# EAGLE design IMU Layer final (EAGLE 6.1)
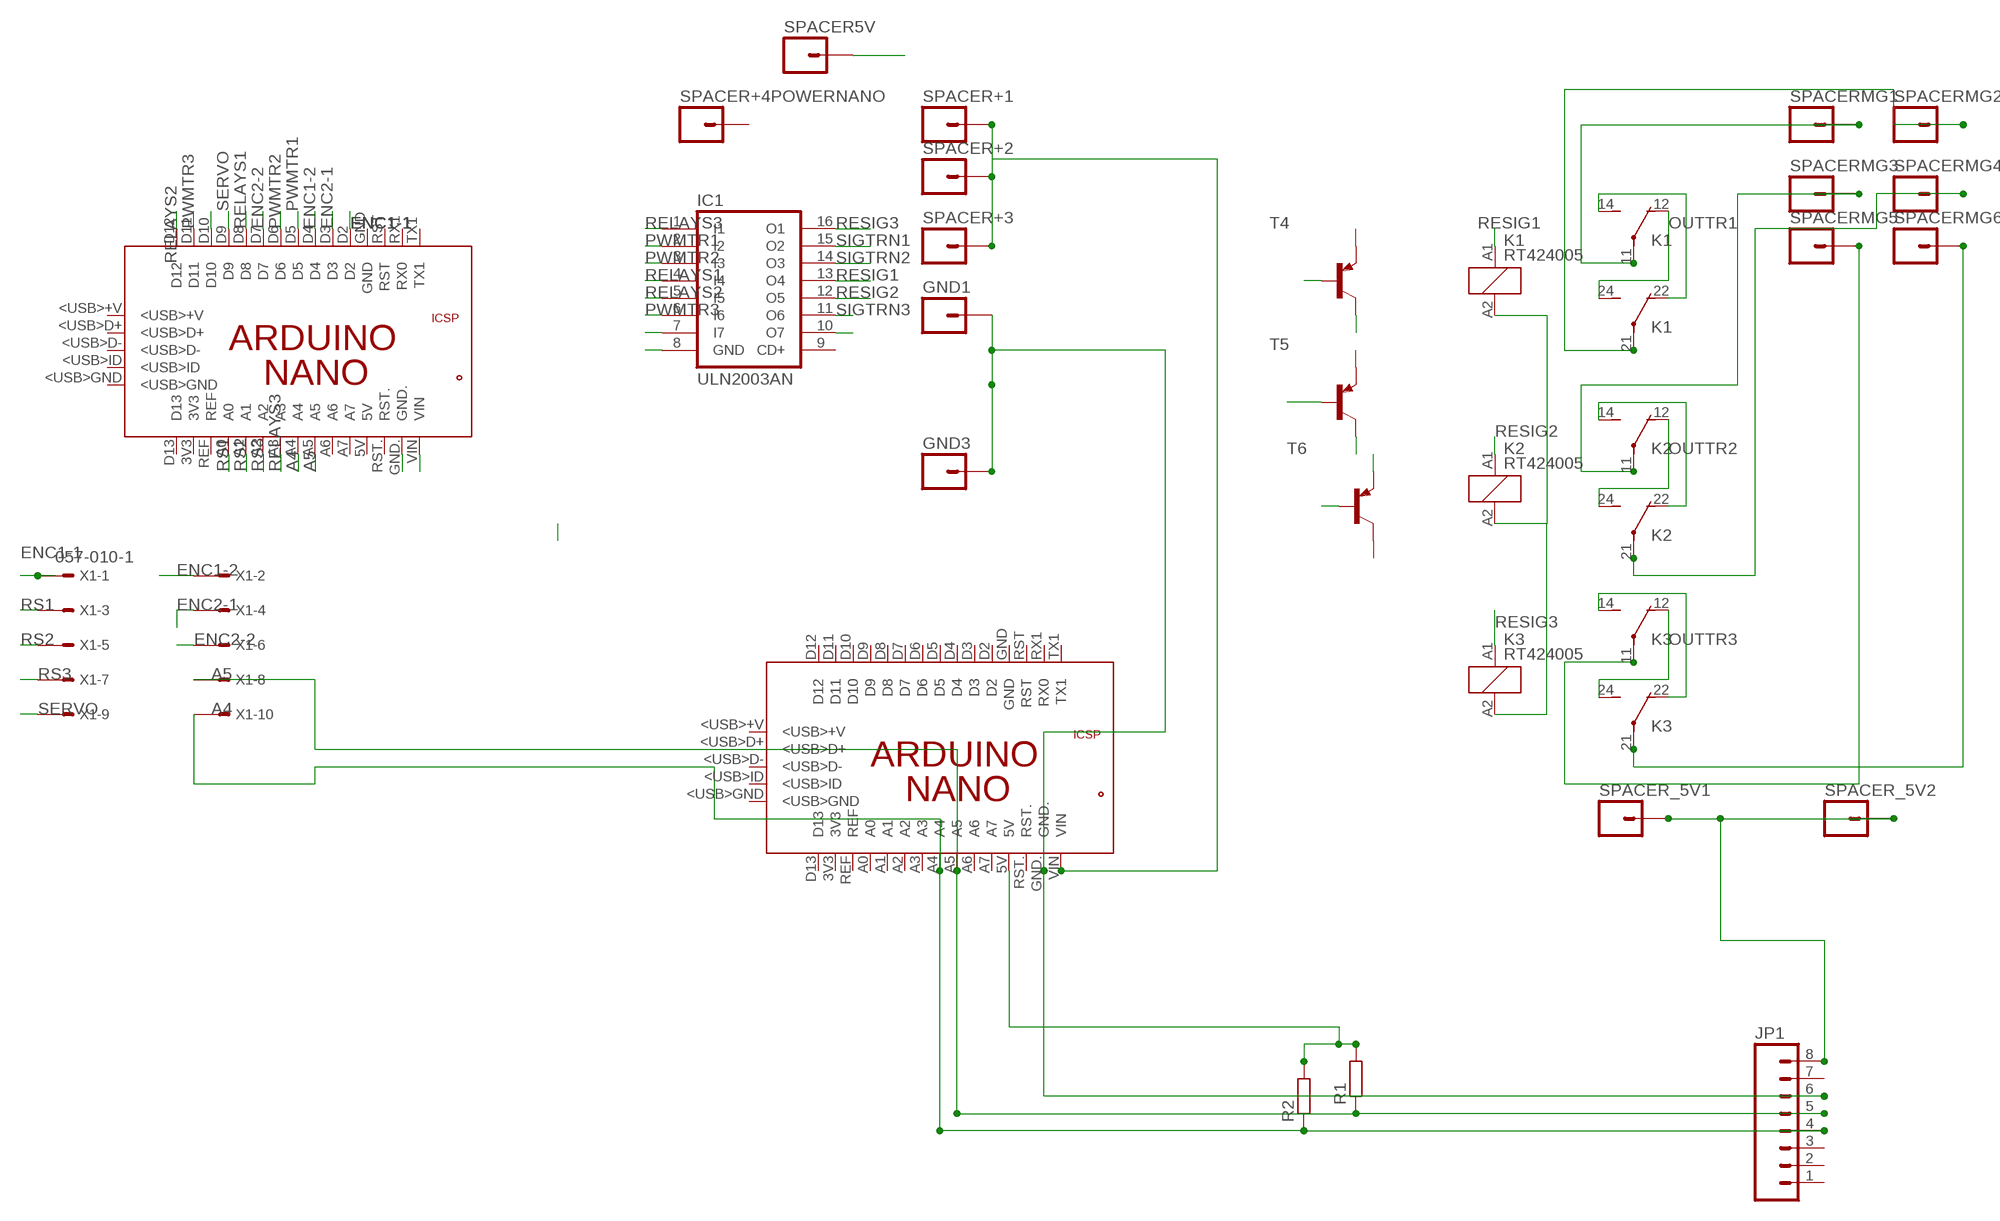
[diagram p0: schematic, sheet 1]

## Parts
GND1  M01PTH_2MM  [1X01_2MM]
GND3  M01PTH_2MM  [1X01_2MM]
IC1  ULN2003AN  [DIL16]
JP1  M08LONGPADS  [1X08_LONGPADS]
K1  RT424005  [RT2C/O]
K2  RT424005  [RT2C/O]
K3  RT424005  [RT2C/O]
PCB1  ARDUINO_NANO  [ARDUINO_NANO]
PCB3  ARDUINO_NANO  [ARDUINO_NANO]
R1  R-EU_0207/12  [0207/12]
R2  R-EU_0207/12  [0207/12]
SPACER5V  M01PTH_2MM  [1X01_2MM]
SPACER+1  M01PTH_2MM  [1X01_2MM]
SPACER+2  M01PTH_2MM  [1X01_2MM]
SPACER+3  M01PTH_2MM  [1X01_2MM]
SPACER+4POWERNANO  M01PTH_2MM  [1X01_2MM]
SPACER_5V1  M01PTH_2MM  [1X01_2MM]
SPACER_5V2  M01PTH_2MM  [1X01_2MM]
SPACERMG1  M01PTH_2MM  [1X01_2MM]
SPACERMG2  M01PTH_2MM  [1X01_2MM]
SPACERMG3  M01PTH_2MM  [1X01_2MM]
SPACERMG4  M01PTH_2MM  [1X01_2MM]
SPACERMG5  M01PTH_2MM  [1X01_2MM]
SPACERMG6  M01PTH_2MM  [1X01_2MM]
T4  -PNP-TO218  [TO218]
T5  -PNP-TO218  [TO218]
T6  -PNP-TO218  [TO218]
X1  057-010-1  [057-010-1]

## Nets
5V: JP1.8 SPACER5V.1 SPACER_5V1.1 SPACER_5V2.1
A4: JP1.4 PCB1.A4 PCB3.A4 R2.1 X1.10
A5: JP1.5 PCB1.A5 PCB3.A5 R1.1 X1.8
ENC1-1: PCB1.D2 X1.1
ENC1-2: PCB1.D4 X1.2
ENC2-1: PCB1.D3 X1.4
ENC2-2: PCB1.D7 X1.6
GND: GND1.1 GND3.1 IC1.8(GND) JP1.6 PCB1.GND. PCB3.GND. T4.3(E) T5.3(E) T6.3(E)
N$1: K1.11(2:P) SPACERMG1.1
N$2: K1.21(3:P) SPACERMG2.1
N$3: PCB3.5V R1.2 R2.2
N$5: K2.11(2:P) SPACERMG3.1
N$6: K2.21(3:P) SPACERMG4.1
N$7: K3.11(2:P) SPACERMG5.1
N$8: K3.21(3:P) SPACERMG6.1
N$12: PCB1.D10
N$18: IC1.7(I7)
N$26: IC1.10(O7)
OUTTR1: K1.12(2:O) K1.24(3:S) T4.2(C)
OUTTR2: K2.12(2:O) K2.24(3:S) T5.2(C)
OUTTR3: K3.12(2:O) K3.24(3:S) T6.2(C)
POWER: K1.14(2:S) K1.22(3:O) K1.A2 K2.14(2:S) K2.22(3:O) K2.A2 K3.14(2:S) K3.22(3:O) K3.A2 PCB1.VIN PCB3.VIN SPACER+1.1 SPACER+2.1 SPACER+3.1
PWMTR1: IC1.2(I2) PCB1.D5
PWMTR2: IC1.3(I3) PCB1.D6
PWMTR3: IC1.6(I6) PCB1.D11
RELAYS1: IC1.4(I4) PCB1.D8
RELAYS2: IC1.5(I5) PCB1.D12
RELAYS3: IC1.1(I1) PCB1.A3
RESIG1: IC1.13(O4) K1.A1
RESIG2: IC1.12(O5) K2.A1
RESIG3: IC1.16(O1) K3.A1
RS1: PCB1.A0 X1.3
RS2: PCB1.A1 X1.5
RS3: PCB1.A2 X1.7
SERVO: PCB1.D9 X1.9
SIGTRN1: IC1.15(O2) T4.1(B)
SIGTRN2: IC1.14(O3) T5.1(B)
SIGTRN3: IC1.11(O6) T6.1(B)
Unconnected: IC1.9(CD+) JP1.1 JP1.2 JP1.3 JP1.7 PCB1.3V3 PCB1.5V PCB1.5V. PCB1.<USB>+V PCB1.<USB>D+ PCB1.<USB>D- PCB1.<USB>GND PCB1.<USB>ID PCB1.A6 PCB1.A7 PCB1.D13 PCB1.GND PCB1.GND_ PCB1.MISO PCB1.MOSI PCB1.REF PCB1.RESET.. PCB1.RST PCB1.RST. PCB1.RX1(RX0) PCB1.SCK PCB1.TX1 PCB3.3V3 PCB3.5V. PCB3.<USB>+V PCB3.<USB>D+ PCB3.<USB>D- PCB3.<USB>GND PCB3.<USB>ID PCB3.A0 PCB3.A1 PCB3.A2 PCB3.A3 PCB3.A6 PCB3.A7 PCB3.D2 PCB3.D3 PCB3.D4 PCB3.D5 PCB3.D6 PCB3.D7 PCB3.D8 PCB3.D9 PCB3.D10 PCB3.D11 PCB3.D12 PCB3.D13 PCB3.GND PCB3.GND_ PCB3.MISO PCB3.MOSI PCB3.REF PCB3.RESET.. PCB3.RST PCB3.RST. PCB3.RX1(RX0) PCB3.SCK PCB3.TX1 SPACER+4POWERNANO.1

## Library data of the parts
GND1 GND3 SPACER5V SPACER+1-SPACER+3 SPACER+4POWERNANO SPACER_5V1 SPACER_5V2 SPACERMG1-SPACERMG6 = SparkFun-Connectors:M01: Header 1 Standard 1-pin 0.1" header. Use with straight break away headers (SKU : PRT-00116), right angle break away headers (PRT-00553), swiss pins (PRT-00743), machine pins (PRT-00117), and female headers (PRT-00115).
IC1 = uln-udn:ULN2003A: DRIVER ARRAY
JP1 = SparkFun-Connectors:M08: Header 8 Standard 8-pin 0.1" header. Use with straight break away headers (SKU : PRT-00116), right angle break away headers (PRT-00553), swiss pins (PRT-00743), machine pins (PRT-00117), and female headers (PRT-00115).
K1-K3 = relay:RT42?*: Power PCB Relay SCHRACK 2 pole 8 A, DC and AC-coil Source: http://www.schrack.com/.. 5842.pdf; MPN: RT424005; OC_FARNELL: 1629052; OC_NEWARK: 03P2425
PCB1 PCB3 = E14_Arduino_revB:ARDUINO_NANO: Device for representing an Arduino Nano board with a footprint in an EAGLE design. Created by Dave Young for Element14. More EAGLE documentation at: http://www.element14.com/community/community/knode/cadsoft_eagle
R1 R2 = resistor:R-EU_: RESISTOR, European symbol
T4-T6 = transistor:*-PNP-: PNP Transistror
X1 = con-panduit:057-010-: CONNECTOR 10-pin series 057 contact pc board low profile headers; OC_FARNELL: unknown; OC_NEWARK: unknown

## Board
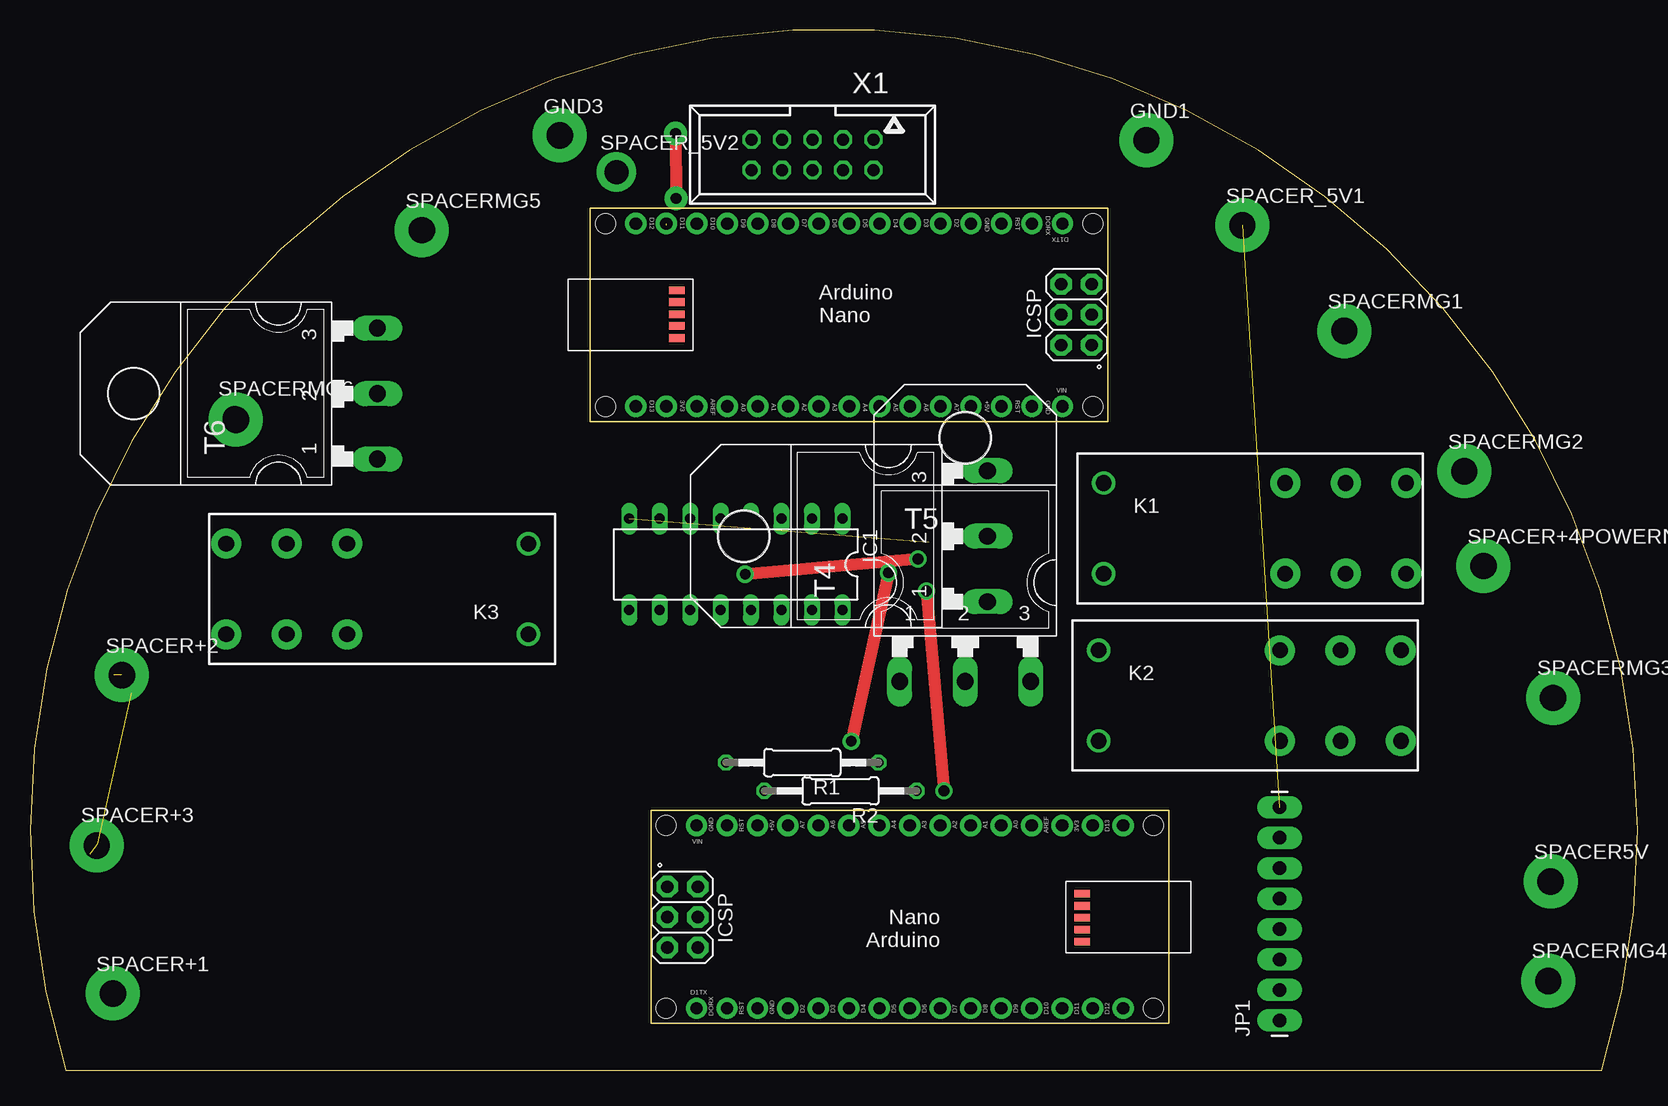
[diagram p1: board, top side]
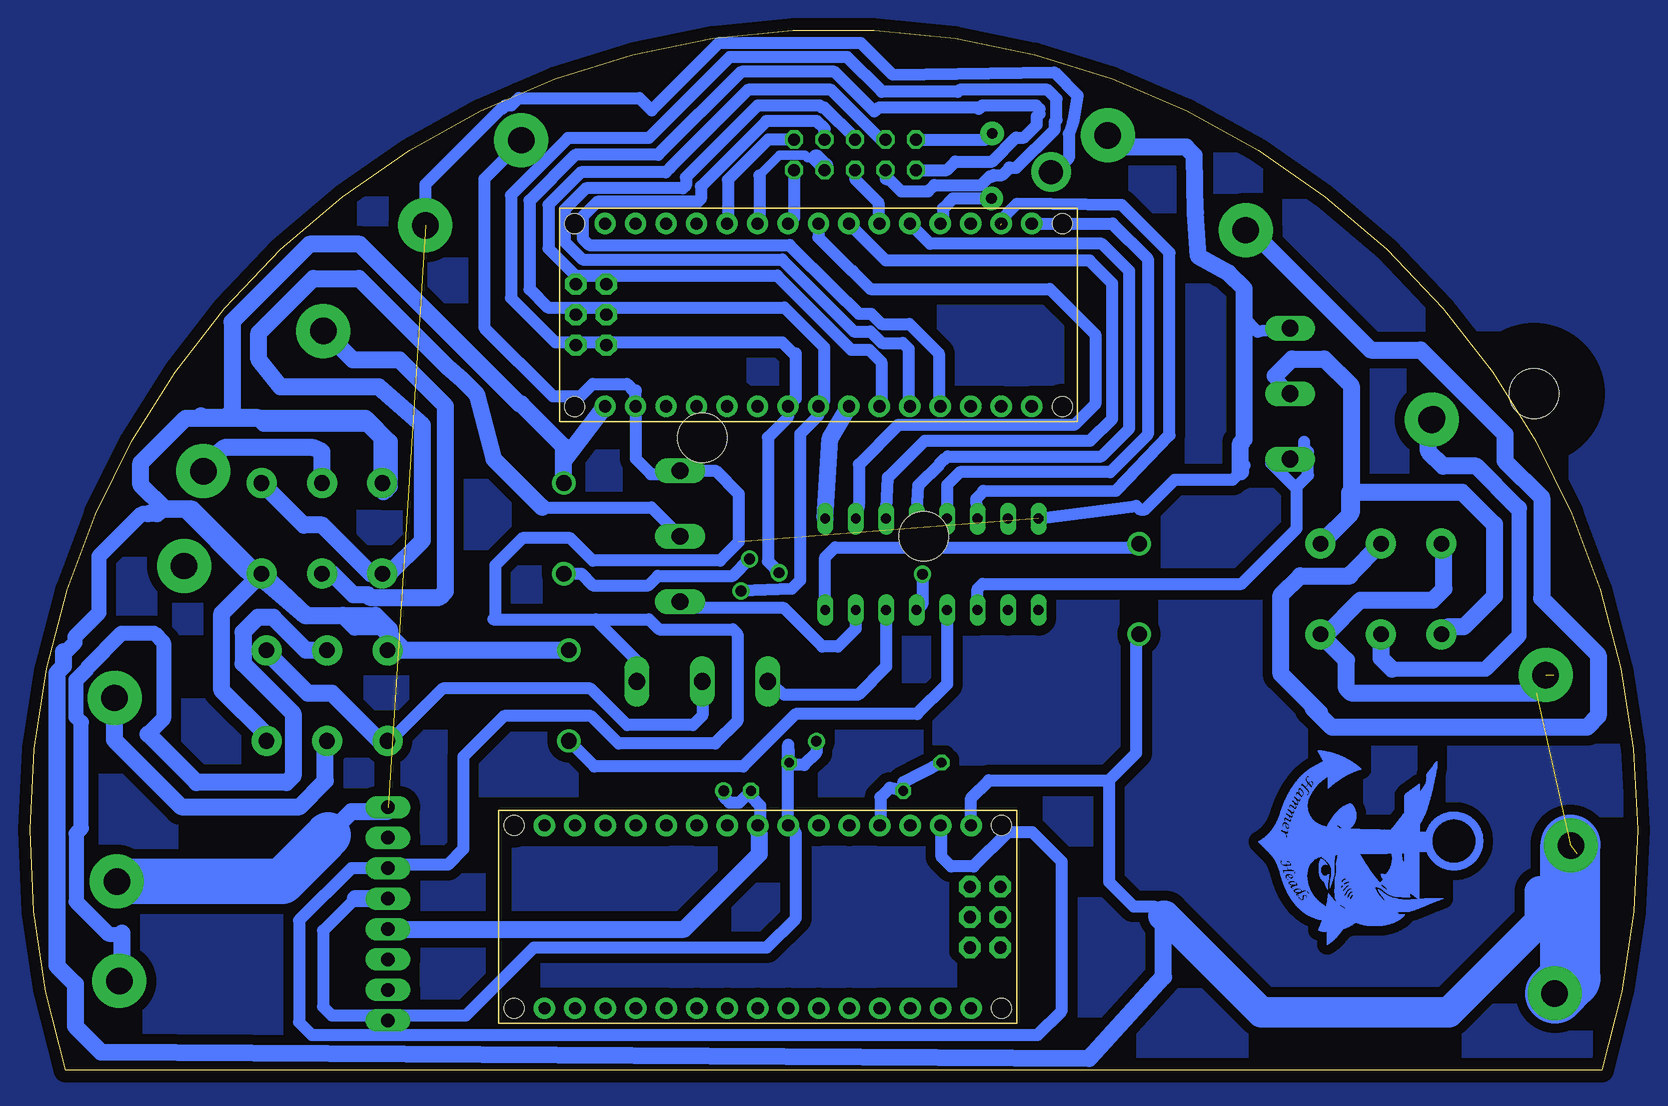
[diagram p2: board, bottom side, seen from below]

Size 134.01 x 86.73 mm. Coordinates in mm from the lower left corner, seen from the top.
Outline: 131.01,0 arc214 3,0 131.01,0
Copper layers (1*16): Top 0.035mm / dielectric 1.5mm / Bottom 0.035mm
Design rules: minimum track width 10mil, minimum drill 24mil, track to track 8mil, track to pad 8mil, pad to pad 8mil, via to via 8mil, smd to smd 8mil, copper to edge 40mil, drill to drill 8mil, minimum pad ring 10mil, minimum via ring 8mil, stop-mask expansion 4mil, vias tented up to drill 0mil, thermal gap 10mil

### Footprints (pad centres in the part's own frame; a part is rotated, then mirrored left to right if it is on the bottom)
1X01_2MM = drill 2 pad 3.302: 1 0,0
DIL16 = drill 0.813 long: 1 -8.89,-3.81; 2 -6.35,-3.81; 3 -3.81,-3.81; 4 -1.27,-3.81; 5 1.27,-3.81; 6 3.81,-3.81; 7 6.35,-3.81; 8 8.89,-3.81; 9 8.89,3.81; 10 6.35,3.81; 11 3.81,3.81; 12 1.27,3.81; 13 -1.27,3.81; 14 -3.81,3.81; 15 -6.35,3.81; 16 -8.89,3.81
1X08_LONGPADS = drill 1.118 pad 1.88 long: 1 0,0; 2 2.54,0; 3 5.08,0; 4 7.62,0; 5 10.16,0; 6 12.7,0; 7 15.24,0; 8 17.78,0
RT2C/O = drill 1.3 pad 2.5: 11 7.56,-3.68; 12 2.52,-3.68; 14 12.6,-3.68; 21 7.56,3.88; 22 2.52,3.88; 24 12.6,3.88 | drill 1.3: A1 -12.6,-3.68; A2 -12.6,3.88
ARDUINO_NANO = drill 1.016 pad 1.778: 3V3 6.35,1.27; 5V 31.75,1.27; A0 11.43,1.27; A1 13.97,1.27; A2 16.51,1.27; A3 19.05,1.27; A4 21.59,1.27; A5 24.13,1.27; A6 26.67,1.27; A7 29.21,1.27; D2 29.21,16.51; D3 26.67,16.51; D4 24.13,16.51; D5 21.59,16.51; D6 19.05,16.51; D7 16.51,16.51; D8 13.97,16.51; D9 11.43,16.51; D10 8.89,16.51; D11 6.35,16.51; D12 3.81,16.51; D13 3.81,1.27; GND 31.75,16.51; GND. 36.83,1.27; REF 8.89,1.27; RST 34.29,16.51; RST. 34.29,1.27; RX1 36.83,16.51; TX1 39.37,16.51; VIN 39.37,1.27 | drill 1.016 pad 1.778 octagon: 5V. 39.268,6.375; GND_ 39.268,11.455; MISO 41.808,6.375; MOSI 39.268,8.915; RESET.. 41.808,11.455; SCK 41.808,8.915 | smd 1.27 x 0.635: <USB>+V 7.214,10.947; <USB>D+ 7.214,9.957; <USB>D- 7.214,8.941; <USB>GND 7.214,6.96; <USB>ID 7.214,7.976 | hole 1.651: 1.27,1.27; 1.27,16.51; 41.91,16.51; 41.91,1.27
0207/12 = drill 0.813 octagon: 1 -6.35,0; 2 6.35,0
TO218 = drill 1.397 long: 1 -5.461,-10.16; 2 0,-10.16; 3 5.461,-10.16 | hole 4.115: 0,10.16
057-010-1 = drill 1 octagon: 1 -5.08,-1.27; 2 -5.08,1.27; 3 -2.54,-1.27; 4 -2.54,1.27; 5 0,-1.27; 6 0,1.27; 7 2.54,-1.27; 8 2.54,1.27; 9 5.08,-1.27; 10 5.08,1.27

### Placement (x,y rotation side)
GND1  93.03,77.54 0 top
GND3  44.15,77.92 0 top
IC1  58.83,42.18 180 top
JP1  104.16,4.15 90 top
K1  102.11,45.08 0 top
K2  101.68,31.14 0 top
K3  28.95,40.23 180 top
PCB1  46.69,54.08 0 top
PCB3  94.93,21.68 180 top
R1  64.37,25.65 180 top
R2  67.56,23.3 180 top
SPACER5V  126.71,15.77 0 top
SPACER+1  6.87,6.41 0 top
SPACER+2  7.66,32.95 0 top
SPACER+3  5.59,18.83 0 top
SPACER+4POWERNANO  121.17,42.06 0 top
SPACER_5V1  101.04,70.46 0 top
SPACER_5V2  48.88,74.89 0 top
SPACERMG1  109.52,61.66 0 top
SPACERMG2  119.55,49.96 0 top
SPACERMG3  126.98,31.11 0 top
SPACERMG4  126.52,7.52 0 top
SPACERMG5  32.65,70.04 0 top
SPACERMG6  17.04,54.39 0 top
T4  69.65,44.53 90 top
T5  77.96,42.57 0 top
T6  18.8,56.41 90 top
X1  65.23,76.33 180 top

### Tracks (layer width: path | path; a pad name or v marks a point on that pad's centre or on a via)
5V  (1 unrouted)
  Bottom 1: SPACER_5V1.1 101.04,73.86 94.76,80.14 94.66,80.14 94.36,80.44 93.86,80.44 93.26,81.04 83.2,81.04 82.18,80.03 76.55,85.66 64.76,85.66 62.1,83 48.62,83.2 46.68,81.26 47.08,79.01 47.41,78.08 47.41,76.06 48.79,74.68 48.79,74.8 SPACER_5V2.1 | 48.8,75.71 49.29,75.22 49.21,75.22 SPACER_5V2.1 | SPACER_5V2.1 48.88,74.84 48.99,74.73
  Bottom 1.422: JP1.8 104.16,21.65 104.26,21.55 107.22,21.55 109.55,19.23
  Bottom 3.81: SPACER5V.1 113,15.77 109.55,19.23 109.16,19.61
A4  (via drill 0.9 pad 1.42)
  Top 1.016: v74.73,39.96 v76.18,23.29
  Bottom 1: PCB1.A4 67.81,55.82 67.81,60.29 71.11,63.59 90.85,63.59 92.37,65.11 92.37,72.5 88.55,76.32 81.63,76.32 74.71,83.24 66.93,83.24 63.62,79.93 63.31,80.24 54.92,80.24 54.92,80.14 54.64,80.42 50.13,80.42 49.85,80.14 49.85,79.71 49.9,79.71 50.07,79.54 50.07,78.82 51.13,77.76 51.8,77.76 53.79,75.77 56.86,75.77 57.57,75.06 X1.10
  Bottom 1.016: PCB3.A4 73.13,20.62 73.13,22.05 73.91,22.82 R2.1 74.88,22.33 75.7,22.33 76.18,22.81 v76.18,23.29 | PCB1.A4 68.28,54.58 69.81,53.06 69.81,40.84 70.52,40.13 v74.73,39.96
  Bottom 1.422: JP1.4 79.47,11.77 73.2,18.04 73.2,19.59 PCB3.A4
A5  (via drill 0.9 pad 1.42)
  Top 1.016: v71.56,41.48 v68.46,27.43
  Bottom 1: X1.8 62.69,74.3 62.4,74.3 61.39,73.29 59.14,73.29 58.62,73.81 54.72,73.81 54.01,74.52 53.76,74.52 53.65,74.63 52.95,74.63 52.37,75.21 | 70.19,59.79 70.19,59.57 | 70.19,59.57 70.19,55.98 PCB1.A5 | JP1.5 106.91,14.31 109.58,11.64 109.58,5.31 108.84,4.57 97.67,4.57 92,10.24 72.59,10.24 70.16,12.67 | 56.58,81.66 56.65,81.59 56.66,81.59 | 56.66,81.59 56.67,81.58 63,81.58 65.89,84.47 75.68,84.47 82.44,77.71 89.15,77.71 93.92,72.94 93.92,64.39 90.22,60.69 71.31,60.69 70.19,59.57 | 52.37,75.21 52.37,75.28 52.32,75.28 | 56.66,81.59 56.52,81.73 49.18,81.73 48.43,80.98 48.43,79.22 48.6,79.05 48.58,79.03 48.58,78.45 51.8,75.23 52.35,75.23 52.37,75.21
  Bottom 1.016: 70.16,12.67 70.16,19.77 PCB3.A5 70.8,27.14 R1.1 70.52,25.45 69.48,25.45 68.46,26.47 v68.46,27.43 | PCB1.A5 70.82,54.43 72.5,52.76 72.5,42.42 v71.56,41.48
  Bottom 1.422: JP1.5 106.86,14.31
ENC1-1
  Bottom 1: X1.1 72.47,77.6 75.83,74.24 75.83,70.61 75.88,70.56 75.88,70.57 PCB1.D2
ENC1-2
  Bottom 1: X1.2 70.31,71.1 PCB1.D4
ENC2-1
  Bottom 0.8: 68.47,76.08 69.19,76.08 69.42,76.31 71.51,76.31 73.21,74.61
  Bottom 1: 73.21,74.61 73.21,70.57 73.48,70.3 73.48,70.47 PCB1.D3
  Bottom 1.422: X1.4 67.77,75.38 68.47,76.08
ENC2-2
  Bottom 1: X1.6 65.23,74.3 63.28,72.35 63.28,70.67 PCB1.D7 | PCB1.D7 63.16,70.55 63.16,70.63 | 63.16,70.82 63.16,70.63 | 63.16,70.63 PCB1.D7
GND  (1 unrouted)
  Bottom 1: PCB1.GND. 83.52,56.59 | 83.52,56.59 83.52,56.69 | GND1.1 92.97,77.48 92.95,77.48 96.13,74.3 96.13,61.92 90.4,56.19 88.12,56.19 87.1,57.21 84.25,57.21 83.63,56.59 83.52,56.59 | IC1.8 41.79,47.06 41.49,46.76 41.06,46.76 38.58,49.24 33.75,49.24 33.1,49.89 | 32.77,50.45 33.1,50.12 | JP1.6 107.21,16.85 111.58,12.48 111.58,4 110.52,2.94 50.01,2.94 47.99,4.96 47.99,17.38 50.46,19.85
  Bottom 1.016: PCB1.GND. 83.52,50.98 82.25,49.71 79.18,49.71 78.95,49.94 79.76,49.94 T4.3 | 79.86,50.04 T4.3 | T4.3 76.87,49.99 74.94,48.06 74.94,44.04 76.49,42.5 87.1,42.5 88.98,44.38 92.95,44.38 95.23,42.09 95.23,37.75 95.38,37.59 86.85,37.59 | T5.3 83.19,33.94 86.85,37.59 | T6.3 31.68,61.57 32.79,62.69 | 50.46,19.85 52.5,19.85 55.35,16.99 57.23,16.99 58.02,17.78 58.02,20.33 PCB3.GND. | 86.85,37.59 82.4,37.59 81.57,36.76 75.42,36.76 75.04,36.37 75.04,29.08 76.89,27.23 84.94,27.23 87.26,29.54 94.49,29.54 97.9,26.14 97.9,18.44 99.19,17.15 103.87,17.15 JP1.6
  Bottom 1.422: GND1.1 93.24,77.54 93.66,77.96 92.89,77.96 | 33.1,49.89 33.1,50.12 33.1,52.28 32.79,52.59 32.79,62.69 32.79,65.16 34.1,66.47 36.6,67.85 36.85,71.5 36.95,76.27 37.64,76.96 43.19,76.96 GND3.1
N$1
  Bottom 1.422: K1.11 108.8,41.4 107.06,39.66 105.86,39.66 105.84,39.64 105.84,39.59 105.68,39.43 99.87,39.43 99.36,39.94 99.36,55.37 103.21,59.22 107.08,59.22 SPACERMG1.1
N$2
  Bottom 1.422: K1.21 109.67,51.58 110.4,51.9 117.8,51.9 119.54,50.51 119.54,49.43 119.55,49.44 SPACERMG2.1
N$3
  Bottom 1.016: R1.2 61.21,24.03 R2.2 62.34,23.55 63.13,22.76 63.13,20.46 PCB3.5V
N$4
  pour Bottom (isolate 0.813): 1.4,93.04 146.84,93.04 146.84,-7.52 -8.96,-7.52 -8.96,93.96 1.4,93.96
N$5
  Bottom 1.422: SPACERMG3.1 126.98,27.56 121.39,21.97 111.54,21.97 109.38,24.13 109.38,27.32 K2.11
N$6
  Bottom 1.27: 126.34,11.44 126.44,11.34 127.46,11.34 130.16,14.04 130.16,19.74 129.72,20.18 129.72,29.01 130.16,29.44 130.16,32.54 129.16,33.54 129.16,33.64 126.36,36.44 123.66,36.44 122.86,35.64 122.86,29.33 124.16,28.03
  Bottom 1.422: K2.21 110.99,35.02 113.72,37.75 115.02,37.75 116.24,36.53 116.24,33.91 112.07,29.74 112.07,24.54 112.62,23.99 120.12,23.99 124.16,28.03 | 126.34,11.44 126.34,7.83 126.87,7.3 126.74,7.3 SPACERMG4.1
N$7
  Bottom 1.422: 26.95,30.27 29.72,33.04 29.72,39.61 28.12,41.21 23.96,41.21 23.96,41.34 K3.11 | 26.95,30.27 26.49,29.81 | SPACERMG5.1 32.22,70.04 22.24,60.06 18.08,60.06 11.05,53.03 11.05,50.81 8,47.76 8,39.34 3.28,34.62 3.28,29.53 4.21,28.6 25.48,28.6 27.05,30.17 26.95,30.27
N$8
  Bottom 1.27: 20.47,33.45 12.65,33.45 9.86,36.24 9.86,46.77 10.05,46.96
  Bottom 1.422: K3.21 21.39,34.37 20.47,33.45 | 9.93,46.84 10.05,46.96 13.45,50.36 16.21,50.36 17.44,51.59 17.44,54.31 17.12,54.63 17.12,54.47 SPACERMG6.1
N$9  (via drill 2.2 pad 4.5)
  other vias: 6.92,6.4
N$10  (via drill 2.2 pad 4.5)
  other vias: 5.56,18.74
N$11  (via drill 2.2 pad 4.5)
  other vias: 7.66,32.94
N$13  (via drill 2.2 pad 4.5)
  other vias: 17.16,54.24
N$14  (via drill 2.2 pad 4.5)
  other vias: 32.66,70.04
N$15  (via drill 2.2 pad 4.5)
  other vias: 44.16,77.94
N$16  (via drill 2.2 pad 4.5)
  other vias: 93.06,77.54
N$17  (via drill 2.2 pad 4.5)
  other vias: 101.06,70.44
N$19  (via drill 2.2 pad 4.5)
  other vias: 109.56,61.64
N$20  (via drill 2.2 pad 4.5)
  other vias: 119.56,49.94
N$21  (via drill 2.2 pad 4.5)
  other vias: 121.16,42.04
N$22  (via drill 2.2 pad 4.5)
  other vias: 126.76,15.74
N$23  (via drill 2.2 pad 4.5)
  other vias: 126.56,7.44
N$24  (via drill 2.2 pad 4.5)
  other vias: 126.96,31.04
OUTTR1
  Bottom 1.016: 91.3,46.92 82.21,46.92 T4.2
  Bottom 1.422: K1.24 111.19,45.44 109.64,45.44 105.6,41.4 K1.12 104.06,41.4 101.28,44.18 101.28,53.76 104.94,56.96 113.11,56.96 114.94,59.25 114.94,61.47 110.39,66.02 106.58,66.02 99.22,58.66 98,57.59 96.78,56.37 95.34,50.96 91.3,46.92
OUTTR2
  Bottom 1.016: T5.2 77.96,29.57 78.75,28.78 84.23,28.78 87.28,31.83 99.6,31.83 104.1,27.33 104.1,27.35 K2.12
  Bottom 1.422: K2.12 104.87,27.46 108.83,31.42 110.83,31.42 114.16,34.75 114.16,34.9 K2.24
OUTTR3
  Bottom 1.016: T6.2 29.98,57.64 30.23,57.89
  Bottom 1.422: 30.23,57.89 28.81,59.31 26.11,59.31 23.87,57.07 23.87,46.47 K3.12 26.36,43.91 23.99,46.28 23.99,48.14 23.93,48.2 14.63,48.2 11.93,45.5 11.93,39.52 14.49,36.96 15.74,36.96 K3.24
POWER  (3 unrouted)
  Bottom 1.016: PCB3.VIN 55.56,22.71 54.08,24.18 44.05,24.18 | 44.05,24.18 41.79,26.44 41.79,36.12 K3.A2 | 44.05,24.18 44.05,15.7 42.02,13.67 40.3,13.67 39.51,12.88
  Bottom 1.27: 124.18,46.41 124.69,46.41 128.26,42.84 128.26,38.14 130.26,36.14 130.26,35.64 131.06,34.84 131.18,34.84 131.22,34.89
  Bottom 1.422: 8.16,14.91 5.02,18.05 | 6.97,32.95 8.45,31.47 23.89,31.47 24.26,31.84 24.26,34.18 K3.22 25.95,36.35 23.1,39.2 17.08,39.2 16.14,40.14 16.14,43.7 K3.14 | K2.14 114.28,27.94 118.02,31.68 118.02,38.09 K1.14 | K1.14 114.68,41.4 110.96,37.88 105.23,37.95 104.03,36.75 104.03,34.88 103.77,34.62 103.8,34.62 K2.22 K2.A2 102.79,35.02 104.72,36.95 106.94,36.95 107.91,37.92 111.06,37.88 115.42,41.6 115.89,41.6 121.02,46.73 123.09,46.73 123.41,46.41 124.18,46.41 | K1.14 115.1,41.4 120.48,46.78 122.73,46.78 124.76,48.81 124.76,50.63 121.02,54.37 106.04,54.37 104.06,52.39 104.06,48.7 104.54,48.22 104.54,48.87 K1.22 104.63,52.71 105.85,53.93 114.49,53.93 114.97,54.41 117.7,54.41 | 117.7,54.41 119.6,54.41 119.76,54.57 | PCB1.VIN 89.51,50.8 K1.A2 89.51,52.01 93.05,55.55 93.2,55.55 106.52,68.87 110.7,68.87 117.17,62.4 117.17,54.94 117.7,54.41 | 39.51,12.88 39.51,7.79 45.71,0.98 128.09,1.54 130.23,3.68 130.23,7.18 131.77,8.72 131.77,33.12 131.22,33.67 131.22,34.89
  Bottom 2.54: 8.16,14.91 8.16,12.42 15.73,4.85 31.38,4.85 39.4,12.88 39.51,12.88
  Bottom 5: SPACER+1.1 5.59,7.69 SPACER+3.1
PWMTR1
  Bottom 1: PCB1.D5 68.28,69.43 65.48,66.63 65.44,66.63 63.95,65.14 49,65.14 45.21,61.35 45.21,55.54 46.95,53.8 61.64,53.8 64.92,50.52 64.92,47.17 IC1.2
PWMTR2
  Bottom 1: IC1.3 62.49,49.42 59.42,52.49 45.63,52.49 43.79,54.33 43.79,65.6 45.69,67.5 62.65,67.5 PCB1.D6
PWMTR3  (1 unrouted)
  Bottom 1: IC1.6 55.12,47.63 54.54,48.31 43.45,48.33 39.02,52.95 39.02,68.16 42.99,72.13 51.75,72.24 52.46,71.53 53.23,70.63 53.05,70.45
RELAYS1
  Bottom 1: IC1.4 59.95,48.78 58.17,50.56 58.17,50.59 57.82,50.94 57.76,50.94 57.52,51.18 44.71,51.18 42.37,53.52 42.37,66.63 44.65,68.91 58.98,68.91 PCB1.D8
RELAYS2
  Bottom 1: PCB1.D12 43.76,70.59 40.82,67.65 40.82,53 43.96,49.86 56.5,49.86 57.56,48.8 IC1.5
RELAYS3
  Bottom 1.422: IC1.1 67.31,52.68 PCB1.A3
RESIG1  (via drill 0.9 pad 1.42)
  Top 1.016: v74.02,42.62 v59.62,41.35
  Bottom 1.016: K1.A1 88.07,41.4 87.1,40.44 82.46,40.44 81.67,41.23 75.42,41.23 v74.02,42.62 | v59.62,41.35 59.62,38.85 IC1.13
RESIG2
  Bottom 1.016: IC1.12 57.56,32.18 60.05,29.69 70.19,29.69 74.56,25.33 86.95,25.33 K2.A1
RESIG3
  Bottom 1: IC1.16 67.72,42.76 66.88,43.6 41.46,43.6 K3.A1
RS1
  Bottom 1: X1.3 67.77,78.48 68.43,79.14 72.61,79.14 78.08,73.67 78.08,72.65 78.33,72.4 86.7,72.4 87.93,71.17 87.93,69.35 87.38,68.8 70.68,68.8 67,65.12 66.97,65.12 64.92,63.07 63.89,63.07 63.04,62.22 60.7,62.22 58.24,59.76 58.24,55.47 PCB1.A0
RS2
  Bottom 1: X1.5 65.23,77.69 67.81,80.27 68.01,80.27 68.16,80.42 73.35,80.42 79.33,74.44 79.33,73.77 79.57,73.53 87.67,73.53 89.43,71.77 89.43,69.08 87.94,67.59 71.31,67.59 65.32,61.6 63.96,61.6 63,60.64 61.25,60.64 60.77,60.16 60.77,55.46 PCB1.A1
RS3
  Bottom 1: X1.7 63.08,77.6 67.22,81.74 74.17,81.74 80.58,75.33 80.58,75.3 81.02,74.86 88.07,74.86 90.78,72.15 90.78,68.51 88.53,66.26 71.73,66.26 65.55,60.08 64.06,60.08 63.03,59.05 63.03,55.52 PCB1.A2
SERVO  (via drill 0.9 pad 1.93)
  Top 1: v53.8,78.11 v53.86,72.68
  Bottom 1: X1.9 54.31,77.6 v53.8,78.11 | v53.86,72.68 57.09,72.68 57.92,71.85 57.92,70.84 58.04,70.72 58.04,70.67 PCB1.D9
SIGTRN1
  Bottom 1.016: IC1.15 65.18,36.81 66.66,35.33 67.95,35.33 71.15,38.53 79.05,38.53 79.36,38.84 79.58,38.84 T4.1
SIGTRN2
  Bottom 1.016: IC1.14 62.64,33.66 65.01,31.29 71.15,31.29 T5.1
SIGTRN3
  Bottom 1: IC1.11 55.02,40.13 54.6,40.55 33.02,40.55 28.4,45.17 28.4,48.68 27.48,49.6 27.48,51.58 27.79,51.89 27.79,52.41
  Bottom 1.016: 28.4,45.17 28.4,48.46 30.54,50.6 30.03,50.6 T6.1
(copper drawn outside any net)
  shapes: Bottom area x2613